# EasyEDA schematic chargingCircuit.json
TITLE: Sheet_1; REV: 1.0; Date: 2024-05-05; Sheet: 1/1; Drawn By: stevemuhilane; Company: Your Company
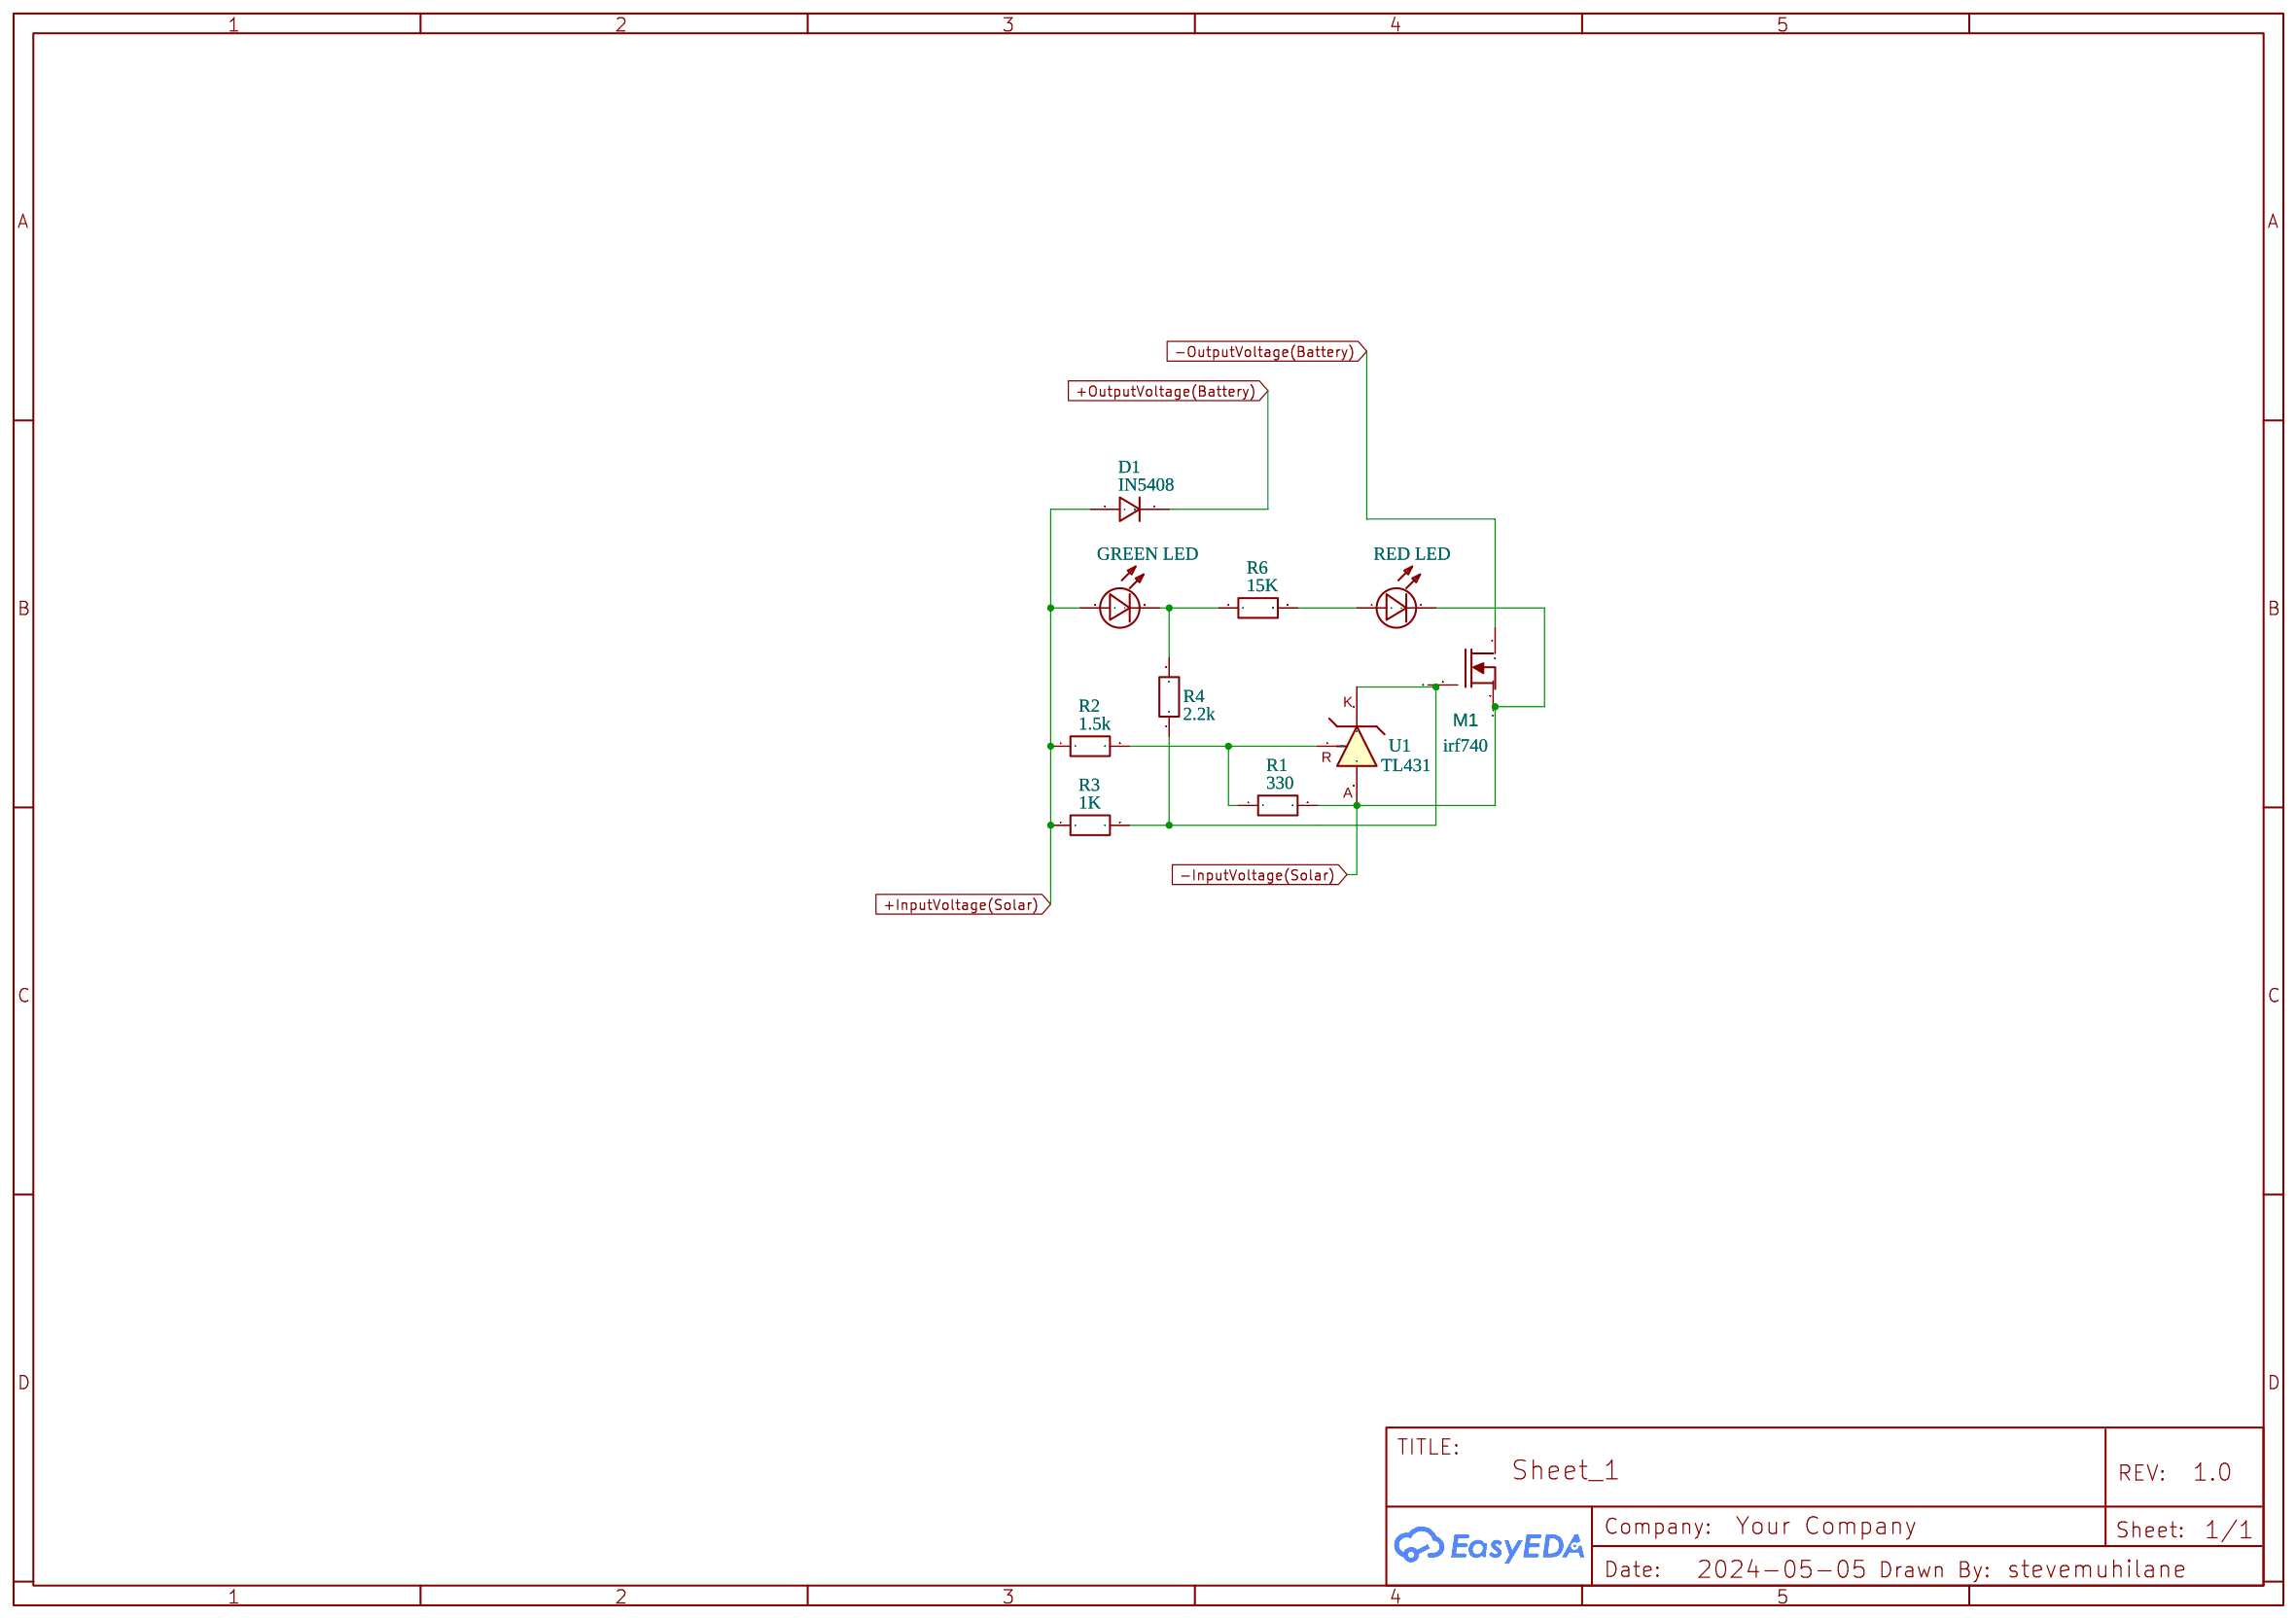
[diagram p0: schematic sheet]

## Parts
D1  IN5408  [D-IN5408]
LED1  GREEN LED  [LED0603_RED]
LED2  RED LED  [LED0603_RED]
M1  irf740  [TO-220]
R1  330  [AXIAL-0.3]
R2  1.5k  [AXIAL-0.3]
R3  1K  [AXIAL-0.3]
R4  2.2k  [AXIAL-0.3]
R6  15K  [AXIAL-0.3]
U1  TL431

## Library data of the parts
D1 = IN5408: catid: 20; Contributor: SidneyWales; sim: true
LED1 LED2 = LED: catid: 20; link: https://www.vishay.com/docs/81009/tsal6100.pdf; Contributor: cocopop; Color: Red; Supplier Part: C111836; sim: true; Manufacturer Part: TSAL6100; Manufacturer: Vishay
M1 = irf740lc: Contributor: Alphabetix; sourceId: JZuMGYSas
R1 R2 R4 R6 = Resistor_EU: Contributor: EasyEDA; Resistance: 1K
R3 = Resistor_EU: Contributor: EasyEDA
U1 = TL431: catid: 20; Contributor: LCEDA_01; sim: true; Manufacturer: TI

## Nets
+InputVoltage(Solar): D1.2(A) LED1.1(+) R2.1 R3.1
+OutputVoltage(Battery): D1.1(C)
-InputVoltage(Solar): LED2.2(-) M1.3(S) R1.2 U1.2(A)
-OutputVoltage(Battery): M1.1(D)
Net-(LED1-2): LED1.2(-) R4.2 R6.1
Net-(LED2-1): LED2.1(+) R6.2
Net-(M1-2): M1.2(G) R3.2 R4.1 U1.3(K)
Net-(R1-1): R1.1 R2.2 U1.1(R)
